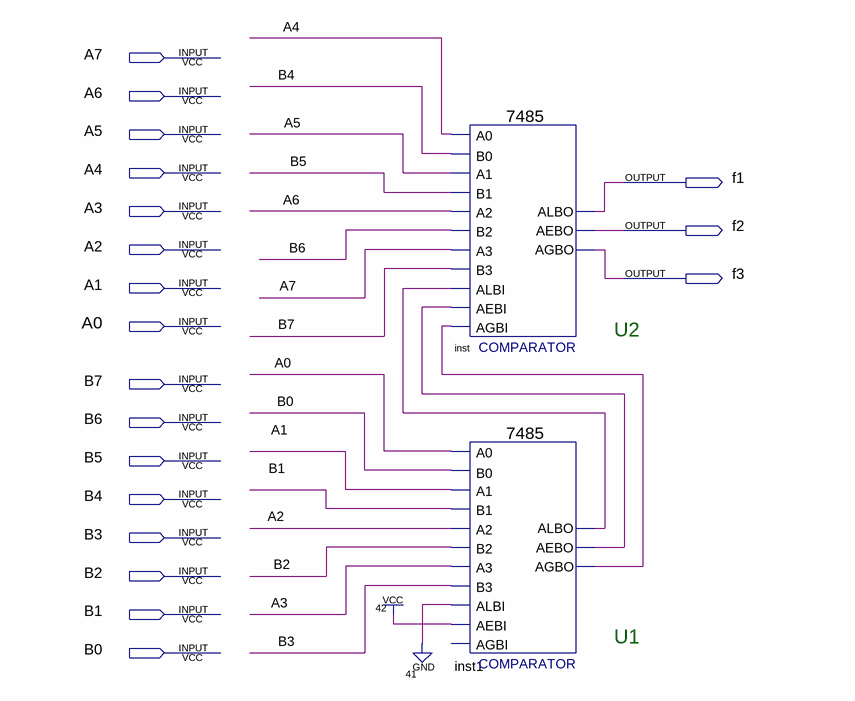
[diagram p0: schematic sheet]
// Quartus schematic 8bit_compare_7485.bdf as structural Verilog: 2 symbols, 19 pins
module \8bit_compare_7485  (
  input  A7,
  input  A6,
  input  A5,
  input  A4,
  input  A3,
  input  A2,
  input  A1,
  input  A0,
  input  B7,
  input  B6,
  input  B5,
  input  B4,
  input  B3,
  input  B2,
  input  B1,
  input  B0,
  output f1,
  output f2,
  output f3
);

  wire inst1_aebo, inst1_agbo, inst1_albo;

  \7485  inst (
    .A3(A7), .B2(B6), .A2(A6), .AEBI(inst1_aebo), .AGBI(inst1_agbo), .ALBI(inst1_albo), .A0(A4), .B0(B4),
    .B3(B7), .A1(A5), .B1(B5), .ALBO(f1), .AGBO(f3), .AEBO(f2));
  \7485  inst1 (
    .A3(A3), .B2(B2), .A2(A2), .AEBI(1'b1), .ALBI(1'b0), .A0(A0), .B0(B0), .B3(B3), .A1(A1), .B1(B1),
    .ALBO(inst1_albo), .AGBO(inst1_agbo), .AEBO(inst1_aebo));  // open: AGBI

  // Notes on the sheet:
  //   U2
  //   U1
endmodule
